# EAGLE schematic sch1 (EAGLE 7.3.0)
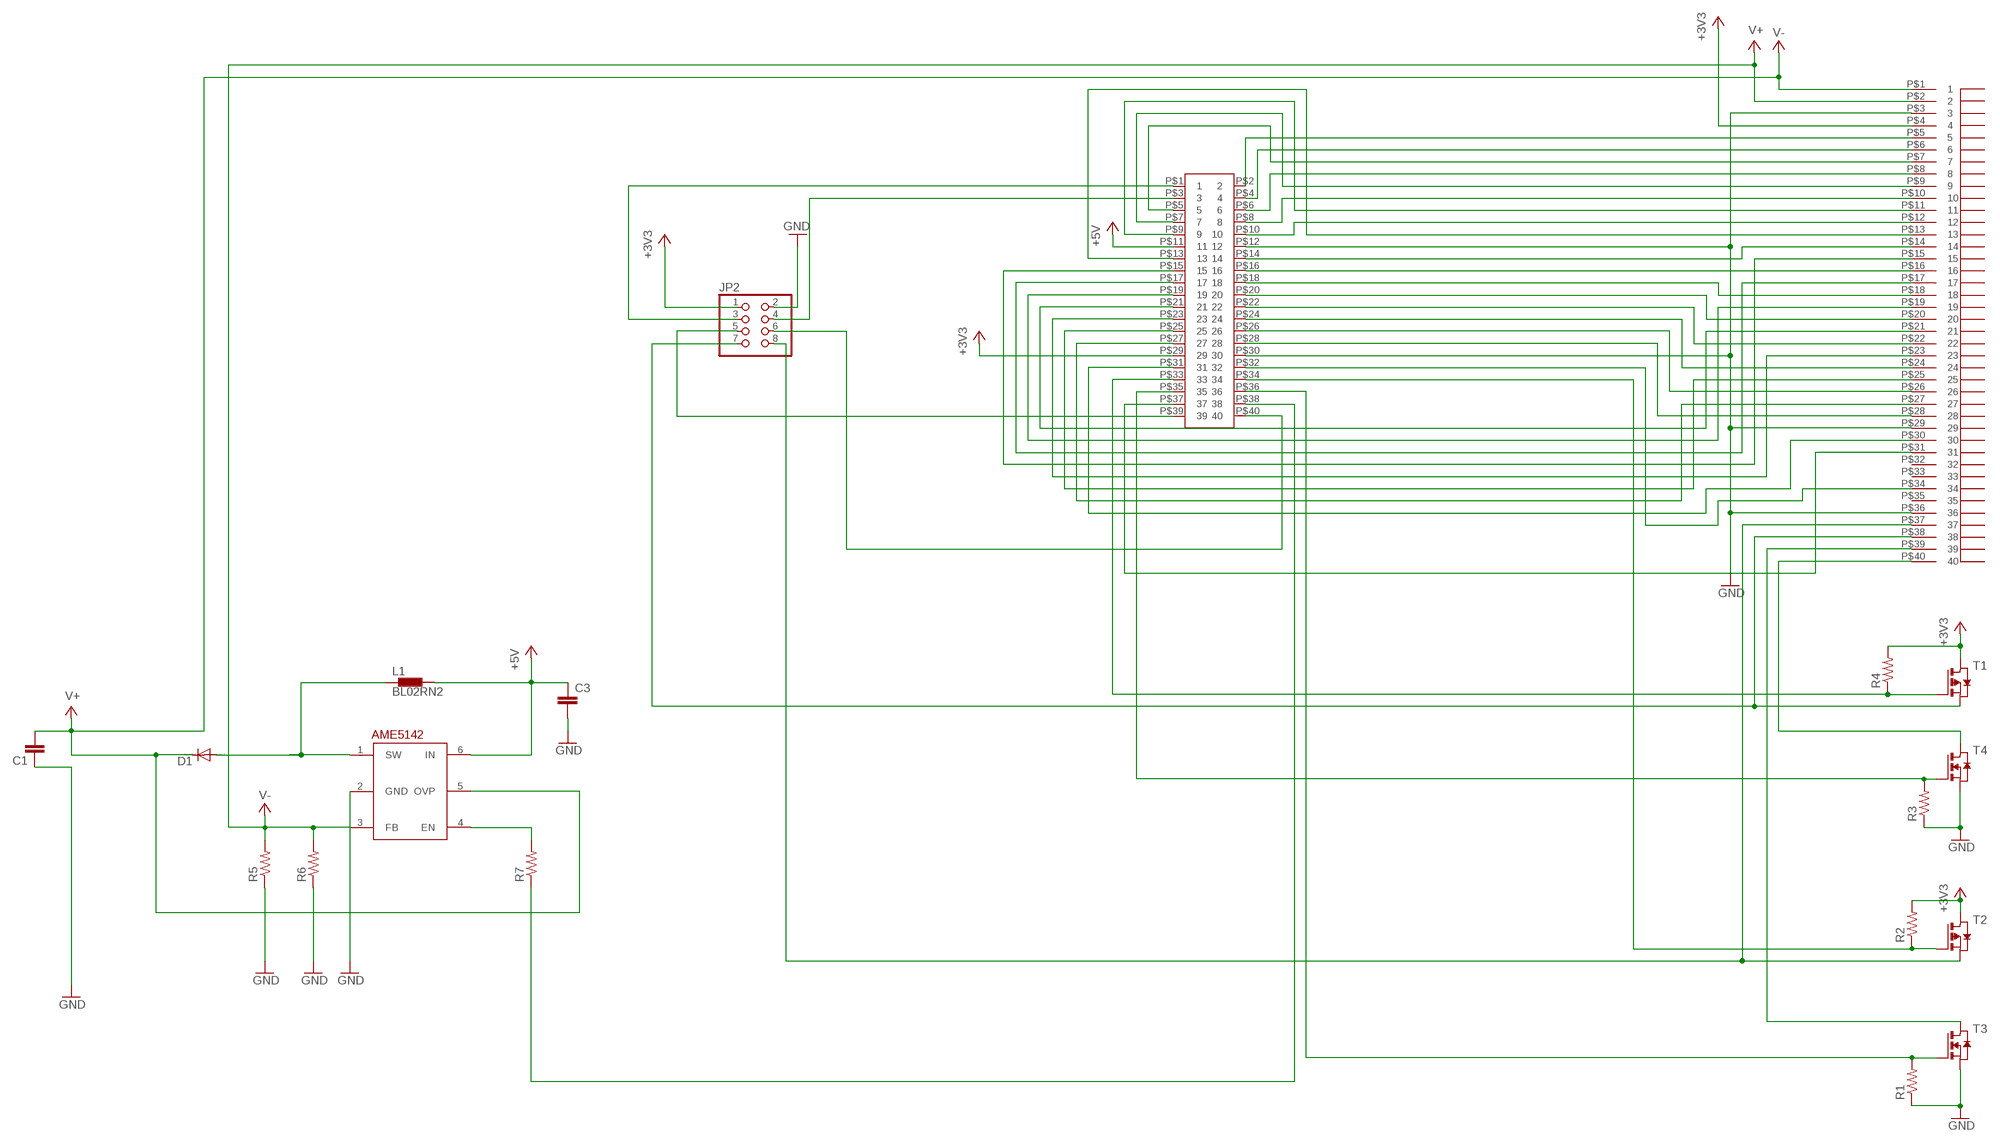
[diagram p0: schematic, sheet 1]

## Parts
C1  C-EUC0805  [C0805]
C3  C-EUC0805  [C0805]
D1  DIODE-DO214AA  [DO214AA]
JP2  PINHD-2X4  [2X04]
L1  BL02RN2  [BL02RN2]
R1  R-US_R0805  [R0805]
R2  R-US_R0805  [R0805]
R3  R-US_R0805  [R0805]
R4  R-US_R0805  [R0805]
R5  R-US_R0805  [R0805]
R6  R-US_R0805  [R0805]
R7  R-US_R0805  [R0805]
T1  PMOSSOT23  [SOT-23]
T2  PMOSSOT23  [SOT-23]
T3  NMOSSOT23  [SOT-23]
T4  NMOSSOT23  [SOT-23]
U$1  DE0_40PIN_HEADER  [HEADER20X2POL]
U$2  AME  [AME]
U$3  FPC_ZIF_PSP40  [FPC_ZIF_40]

## Nets
+3V3: JP2.1 R2.2 R4.2 T1.1(D) T2.1(D) U$1.P$29 U$3.P$4
+5V: C3.1 L1.2 U$1.P$11 U$2.6(IN)
GND: C1.1 C3.2 JP2.2 R1.1 R3.1 R5.1 R6.1 T3.2(S) T4.2(S) U$1.P$12 U$1.P$30 U$2.2(GND) U$3.P$3 U$3.P$29 U$3.P$36
N$1: U$1.P$2 U$3.P$5
N$2: U$1.P$4 U$3.P$6
N$3: R2.1 T2.3(G) U$1.P$34
N$4: R3.2 T4.3(G) U$1.P$35
N$5: U$1.P$5 U$3.P$7
N$6: U$1.P$6 U$3.P$8
N$7: U$1.P$7 U$3.P$9
N$8: U$1.P$8 U$3.P$10
N$9: D1.A L1.1 U$2.1(SW)
N$10: U$1.P$9 U$3.P$11
N$11: U$1.P$10 U$3.P$12
N$12: U$1.P$13 U$3.P$13
N$13: U$1.P$14 U$3.P$14
N$14: U$1.P$15 U$3.P$15
N$15: U$1.P$16 U$3.P$16
N$16: U$1.P$17 U$3.P$17
N$17: U$1.P$18 U$3.P$18
N$18: U$1.P$19 U$3.P$19
N$19: U$1.P$20 U$3.P$20
N$20: U$1.P$21 U$3.P$21
N$21: U$1.P$22 U$3.P$22
N$22: U$1.P$23 U$3.P$23
N$23: U$1.P$24 U$3.P$24
N$24: U$1.P$25 U$3.P$25
N$25: U$1.P$26 U$3.P$26
N$26: U$1.P$27 U$3.P$27
N$27: R7.2 U$2.4(EN)
N$28: U$1.P$28 U$3.P$28
N$29: U$1.P$31 U$3.P$30
N$30: U$1.P$32 U$3.P$34
N$32: JP2.8 T2.2(S) U$3.P$37
N$33: JP2.7 T1.2(S) U$3.P$38
N$34: T3.1(D) U$3.P$39
N$35: T4.1(D) U$3.P$40
N$36: JP2.3 U$1.P$1
N$37: JP2.4 U$1.P$3
N$38: R7.1 U$1.P$38
N$39: U$1.P$37 U$3.P$31
N$40: R1.2 T3.3(G) U$1.P$36
N$41: JP2.5 U$1.P$39
N$42: JP2.6 U$1.P$40
N$43: R4.1 T1.3(G) U$1.P$33
V+: C1.2 D1.C U$2.5(OVP) U$3.P$1 ; supply symbol labelled V-
V-: R5.2 R6.2 U$2.3(FB) U$3.P$2 ; supply symbol labelled V+
Unconnected: U$3.P$32 U$3.P$33 U$3.P$35

## Library data of the parts
C1 = rcl:C-EU: CAPACITOR, European symbol
C3 = resistor:C-EU: CAPACITOR, European symbol
D1 = diode:DIODE-: DIODE
JP2 = pinhead:PINHD-2X4: PIN HEADER
L1 = inductors:BL0: Noise Suppression Products/EMI Suppression Filters, Lead EMIFIL(R) Inductor Type Source: http://www.murata.com .. BL01RN1_DS.pdf
R1-R6 = resistor:R-US_: RESISTOR, American symbol
R7 = rcl:R-US_: RESISTOR, American symbol
T1 T2 = zetex:PMOSSOT23: MOS FET; OC_FARNELL: unknown; OC_NEWARK: unknown
T3 T4 = zetex:NMOSSOT23: MOS FET; OC_FARNELL: unknown; OC_NEWARK: unknown
U$1 = flolib:DE0_40PIN_HEADER
U$2 = AME:AME: AME5142
U$3 = flolib:FPC_ZIF_PSP40